# EAGLE design atmega324-7seg (EAGLE 5.06)
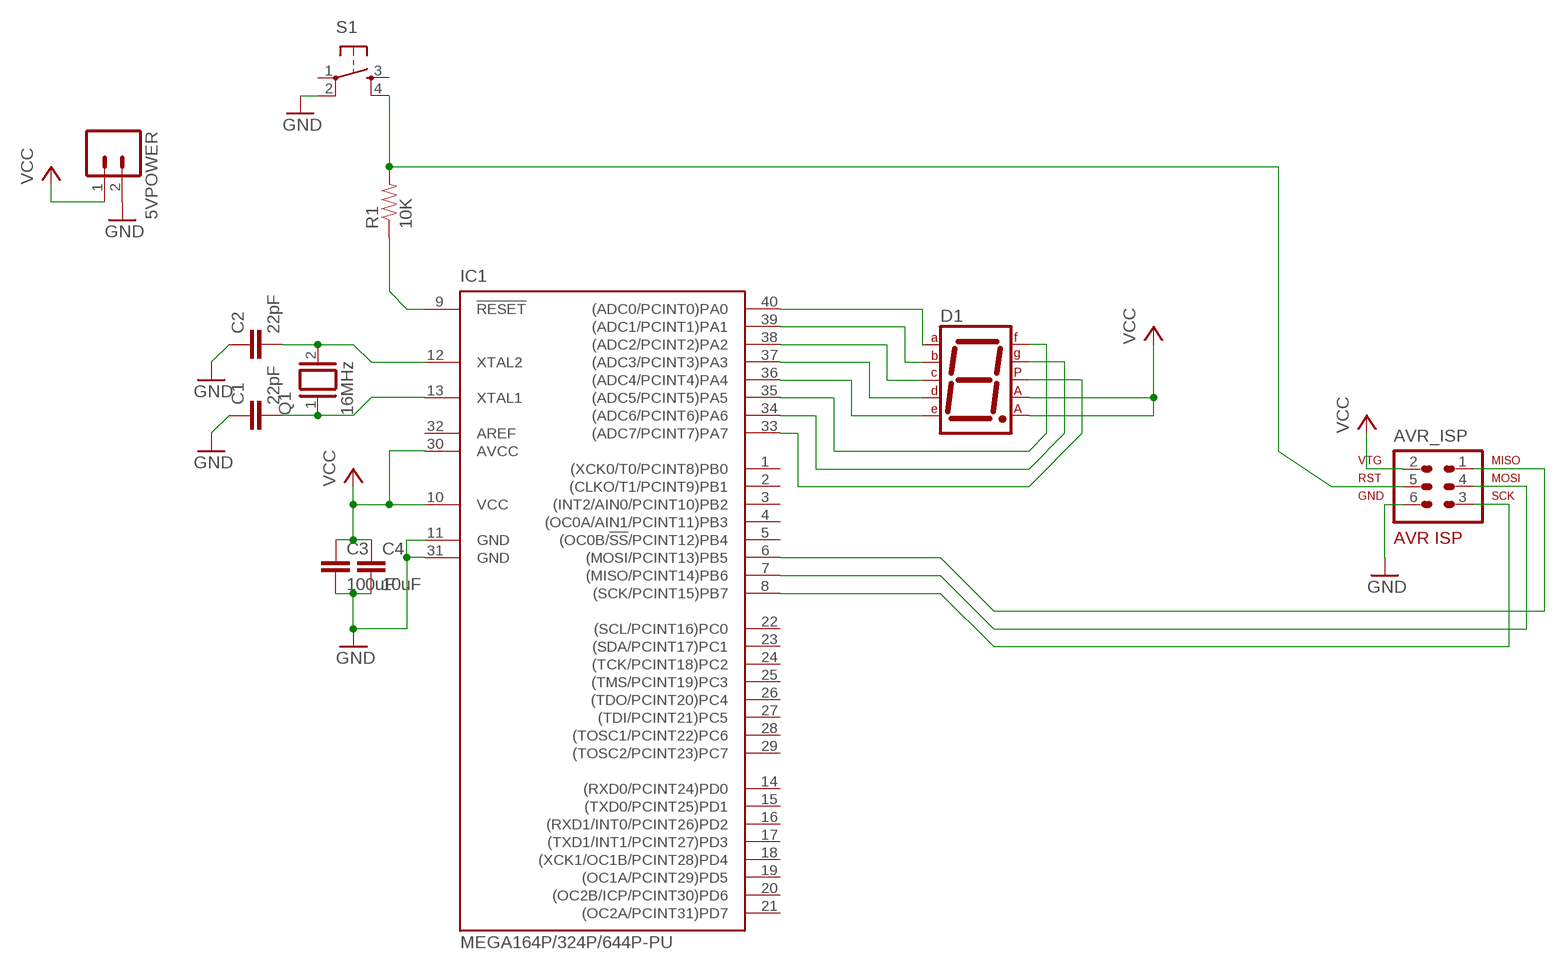
[diagram p0: schematic, sheet 1]

## Parts
5VPOWER  M02LOCK  [1X02_LOCK]
AVR_ISP  AVR-ISP-6  [AVR-ISP-6]
C1  22pF  CAPPTH1  [CAP-PTH-5MM]
C2  22pF  CAPPTH1  [CAP-PTH-5MM]
C3  100uF  CAPPTH1  [CAP-PTH-5MM]
C4  10uF  CAPPTH1  [CAP-PTH-5MM]
D1  7SEG-CA  [7SEG-13]
IC1  MEGA164P/324P/644P-PU  [DIL40]
Q1  16MHz  XTAL  [Q]
R1  10K  RESISTORPTH1  [AXIAL-0.3]
S1  TAC_SWITCH12MM  [TACTILE-PTH-12MM]

## Nets
GND: 5VPOWER.2 AVR_ISP.6 C1.1 C2.1 C3.2 C4.2 IC1.11(GND) IC1.31(GND) S1.2
N$1: AVR_ISP.3 IC1.8((SCK/PCINT15)PB7)
N$2: AVR_ISP.4 IC1.7((MISO/PCINT14)PB6)
N$3: C1.2 IC1.13(XTAL1) Q1.1
N$4: C2.2 IC1.12(XTAL2) Q1.2
N$5: AVR_ISP.1 IC1.6((MOSI/PCINT13)PB5)
N$6: AVR_ISP.5 R1.P$2 S1.4
N$7: IC1.9(!RESET) R1.P$1
N$8: D1.7(A) IC1.40((ADC0/PCINT0)PA0)
N$9: D1.6(B) IC1.39((ADC1/PCINT1)PA1)
N$10: D1.4(C) IC1.38((ADC2/PCINT2)PA2)
N$11: D1.2(D) IC1.37((ADC3/PCINT3)PA3)
N$12: D1.1(E) IC1.36((ADC4/PCINT4)PA4)
N$13: D1.9(F) IC1.35((ADC5/PCINT5)PA5)
N$14: D1.10(G) IC1.34((ADC6/PCINT6)PA6)
N$15: D1.5(DP) IC1.33((ADC7/PCINT7)PA7)
VCC: 5VPOWER.1 AVR_ISP.2 C3.1 C4.1 D1.3(CA1) D1.8(CA2) IC1.10(VCC) IC1.30(AVCC)
Unconnected: IC1.1((XCK0/T0/PCINT8)PB0) IC1.2((CLKO/T1/PCINT9)PB1) IC1.3((INT2/AIN0/PCINT10)PB2) IC1.4((OC0A/AIN1/PCINT11)PB3) IC1.5((OC0B/!SS!/PCINT12)PB4) IC1.14((RXD0/PCINT24)PD0) IC1.15((TXD0/PCINT25)PD1) IC1.16((RXD1/INT0/PCINT26)PD2) IC1.17((TXD1/INT1/PCINT27)PD3) IC1.18((XCK1/OC1B/PCINT28)PD4) IC1.19((OC1A/PCINT29)PD5) IC1.20((OC2B/ICP/PCINT30)PD6) IC1.21((OC2A/PCINT31)PD7) IC1.22((SCL/PCINT16)PC0) IC1.23((SDA/PCINT17)PC1) IC1.24((TCK/PCINT18)PC2) IC1.25((TMS/PCINT19)PC3) IC1.26((TDO/PCINT20)PC4) IC1.27((TDI/PCINT21)PC5) IC1.28((TOSC1/PCINT22)PC6) IC1.29((TOSC2/PCINT23)PC7) S1.1 S1.3

## Power pins joined to a net without a drawn wire
AREF: IC1.32(AREF)

## Library data of the parts
5VPOWER = SparkFun:M02: Header 2 Standard 2-pin 0.1" header. Use with straight break away headers (SKU : PRT-00116), right angle break away headers (PRT-00553), swiss pins (PRT-00743), machine pins (PRT-00117), and female headers (PRT-00115). Molex polarized connector foot print use with SKU : PRT-08233 with associated crimp pins and housings.
AVR_ISP = avr-6:AVR-ISP-6: AVR ISP-6 Serial Programming Header
C1-C4 = SparkFun:CAP: Capacitor Standard 0603 ceramic capacitor, and 0.1" leaded capacitor.
D1 = special:7SEG-CA: 7-segment DISPLAY single anode, 13 mm
IC1 = avr-6:MEGA164P/324P/644P-PU
Q1 = special:XTAL: CRYSTAL
R1 = SparkFun:RESISTOR: Resistor Basic schematic elements and footprints for 0603, 1206, and PTH 1/10th watt (small) resistors.
S1 = SparkFun:TAC_SWITCH: Momentary Switch Button commonly used for reset or general input. Spark Fun Electronics SKU : COM-00097

## Board
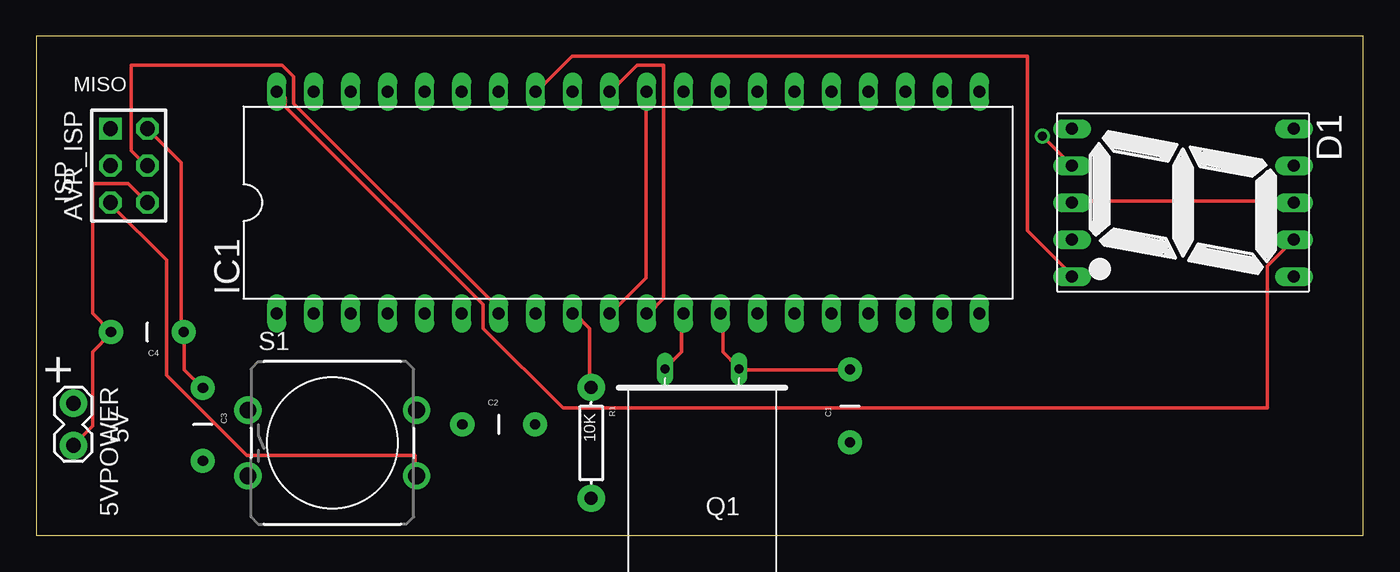
[diagram p1: board, top side]
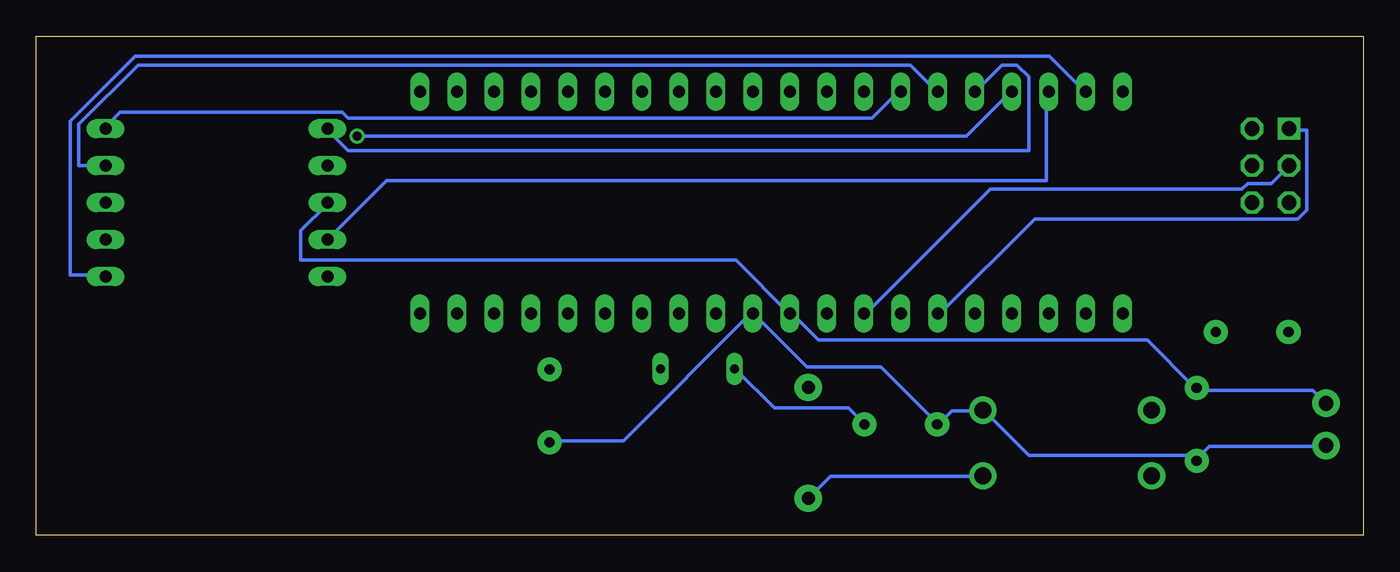
[diagram p2: board, bottom side, seen from below]

Size 91.11 x 34.28 mm. Coordinates in mm from the lower left corner, seen from the top.
Outline: 0,0 91.11,0 91.11,34.28 0,34.28 0,0
Copper layers (1*16): Top 0.035mm / dielectric 1.5mm / Bottom 0.035mm
Design rules "default": minimum track width 10mil, minimum drill 24mil, track to track 8mil, track to pad 8mil, pad to pad 8mil, via to via 8mil, smd to smd 8mil, copper to edge 40mil, drill to drill 8mil, minimum pad ring 10mil, minimum via ring 8mil, stop-mask expansion 4mil, vias tented up to drill 0mil, thermal gap 10mil

### Footprints (pad centres in the part's own frame; a part is rotated, then mirrored left to right if it is on the bottom)
1X02_LOCK = drill 1.016 pad 1.88 round: 1 -0.178,0; 2 2.718,0
AVR-ISP-6 = drill 1.016 square: 1 -2.54,-1.27 | drill 1.016 octagon: 2 -2.54,1.27; 3 0,-1.27; 4 0,1.27; 5 2.54,-1.27; 6 2.54,1.27
CAP-PTH-5MM = drill 0.7 pad 1.651 round: 1 -2.5,0; 2 2.5,0
7SEG-13 = drill 0.813 long: 1 -5.08,-7.62; 2 -2.54,-7.62; 3 0,-7.62; 4 2.54,-7.62; 5 5.08,-7.62; 6 5.08,7.62; 7 2.54,7.62; 8 0,7.62; 9 -2.54,7.62; 10 -5.08,7.62
DIL40 = drill 0.813 long: 1 -24.13,-7.62; 2 -21.59,-7.62; 3 -19.05,-7.62; 4 -16.51,-7.62; 5 -13.97,-7.62; 6 -11.43,-7.62; 7 -8.89,-7.62; 8 -6.35,-7.62; 9 -3.81,-7.62; 10 -1.27,-7.62; 11 1.27,-7.62; 12 3.81,-7.62; 13 6.35,-7.62; 14 8.89,-7.62; 15 11.43,-7.62; 16 13.97,-7.62; 17 16.51,-7.62; 18 19.05,-7.62; 19 21.59,-7.62; 20 24.13,-7.62; 21 24.13,7.62; 22 21.59,7.62; 23 19.05,7.62; 24 16.51,7.62; 25 13.97,7.62; 26 11.43,7.62; 27 8.89,7.62; 28 6.35,7.62; 29 3.81,7.62; 30 1.27,7.62; 31 -1.27,7.62; 32 -3.81,7.62; 33 -6.35,7.62; 34 -8.89,7.62; 35 -11.43,7.62; 36 -13.97,7.62; 37 -16.51,7.62; 38 -19.05,7.62; 39 -21.59,7.62; 40 -24.13,7.62
Q = drill 0.61 long: 1 -2.54,-7.62; 2 2.54,-7.62
AXIAL-0.3 = drill 0.9 pad 1.88 round: P$1 -3.81,0; P$2 3.81,0
TACTILE-PTH-12MM = drill 1.143 pad 1.88 round: 1 -5.791,2.261; 2 5.791,2.261; 3 -5.791,-2.261; 4 5.791,-2.261

### Placement (x,y rotation side)
5VPOWER  2.54,8.89 270 top
AVR_ISP  6.35,25.4 270 top
C1  55.88,8.89 90 top
C2  31.75,7.62 0 top
C3  11.43,7.62 270 top
C4  7.62,13.97 180 top
D1  78.74,22.86 270 top
IC1  40.64,22.86 0 top
Q1  45.72,3.81 180 top
R1  38.1,6.35 270 top
S1  20.32,6.35 0 top

### Tracks (layer width: path | path; a pad name or v marks a point on that pad's centre or on a via)
GND
  Top 0.254: IC1.31 39.42,30.48 41.25,32.31 43.08,32.31 43.08,16.26 42.06,15.24 IC1.11 | AVR_ISP.6 6.3,24.18 3.86,24.18 3.86,15.24 5.08,14.02 C4.2 5.08,13.82 3.86,12.6 3.86,7.52 2.64,6.3 5VPOWER.2
  Bottom 0.254: C1.1 55.88,6.5 50.8,6.5 42.06,15.24 IC1.11 41.86,15.24 38.2,11.58 33.12,11.58 29.26,7.72 C2.1 29.06,7.72 28.25,8.53 26.21,8.53 S1.2 26.01,8.53 22.96,5.49 11.18,5.49 | 11.18,5.49 10.57,6.1 2.64,6.1 5VPOWER.2 | 11.18,5.49 11.38,5.28 C3.2 11.18,5.49
N$1
  Bottom 0.254: AVR_ISP.3 6.3,24.18 7.92,24.18 8.33,23.77 25.6,23.77 34.14,15.24 IC1.8
N$2
  Top 0.254: IC1.7 31.7,15.24 31.29,15.65 31.29,16.05 17.68,29.67 17.68,31.5 16.87,32.31 6.5,32.31 6.5,26.42 7.52,25.4 AVR_ISP.4
N$3
  Top 0.254: IC1.13 47.14,15.24 47.14,12.6 48.16,11.58 Q1.1 48.36,11.38 55.88,11.38 C1.2
N$4
  Top 0.254: Q1.2 43.28,11.58 44.3,12.6 44.3,15.24 IC1.12
  Bottom 0.254: C2.2 34.34,7.72 35.36,8.74 40.44,8.74 43.08,11.38 Q1.2
N$5
  Bottom 0.254: IC1.6 29.06,15.24 22.55,21.74 4.47,21.74 3.86,22.35 3.86,27.84 5.08,27.84 AVR_ISP.1
N$6
  Top 0.254: AVR_ISP.5 5.08,22.76 8.94,18.9 8.94,10.97 14.43,5.49 26.01,5.49 26.01,4.27 S1.4
  Bottom 0.254: R1.P$2 36.58,4.06 26.21,4.06 S1.4
N$7
  Top 0.254: IC1.9 36.98,15.24 38,14.22 38,10.16 R1.P$1
N$8
  Top 0.254: D1.7 84.53,18.49 84.53,8.74 36.17,8.74 30.68,14.22 30.68,15.85 17.07,29.46 17.07,30.07 16.66,30.48 IC1.40
N$9
  Bottom 0.254: IC1.39 19.1,30.48 21.54,32.92 84.33,32.92 88.8,28.45 88.8,17.88 86.36,17.88 D1.6
N$10
  Bottom 0.254: D1.4 67.06,24.38 21.74,24.38 21.74,30.48 IC1.38
N$11  (via drill 0.61)
  Top 0.254: v69.09,27.43 D1.2
  Bottom 0.254: v69.09,27.43 27.23,27.43 24.18,30.48 IC1.37
N$12
  Bottom 0.254: IC1.36 26.62,30.48 24.79,32.31 23.77,32.31 22.96,31.5 22.96,26.42 69.7,26.42 71.12,27.84 D1.1
N$13
  Bottom 0.254: D1.9 88.19,25.4 88.19,28.25 84.12,32.31 31.09,32.31 29.26,30.48 IC1.35
N$14
  Bottom 0.254: IC1.34 31.9,30.48 33.73,28.65 69.7,28.65 70.1,29.06 85.34,29.06 86.36,28.04 D1.10
N$15
  Top 0.254: IC1.33 34.34,30.48 36.78,32.92 68.07,32.92 68.07,20.93 71.12,17.88 D1.5
VCC
  Top 0.254: AVR_ISP.2 9.96,25.6 9.96,14.02 C4.1 10.16,13.82 10.16,11.38 11.38,10.16 C3.1 | D1.3 71.12,22.96 86.36,22.96 D1.8 | IC1.10 39.42,15.24 41.86,17.68 41.86,30.48 IC1.30
  Bottom 0.254: 5VPOWER.1 2.64,9.14 3.45,9.96 11.38,9.96 C3.1 11.58,10.16 14.83,13.41 37.39,13.41 39.22,15.24 IC1.10 39.42,15.24 43.08,18.9 72.95,18.9 72.95,20.93 71.12,22.76 D1.3

### Text on the board
tPlace: MISO | ISP | + | 5V